# Altium schematic sheet Peripherals.SchDoc: Peripherals
size A4; Project: STM32MP15-DISCO PI; Date: Not used; ApprovedBy: Not used; CheckedBy: Not used; Author: Not used; CompanyName: STMicroelectronics; DrawnBy: Not used; Engineer: Not used; Organization: Not used; Address1: Not used; Address2: Not used; Address3: Not used; Address4: Not used; DocumentNumber: 13; Revision: Not used; SheetNumber: 13; SheetTotal: 15; CurrentTime: Not used; CurrentDate: Not used; Time: Not used; DocumentFullPathAndName: Not used; DocumentName: Not used; ModifiedDate: Not used; ImagePath: Not used; ProjectName: Not used; Application_BuildNumber: Not used
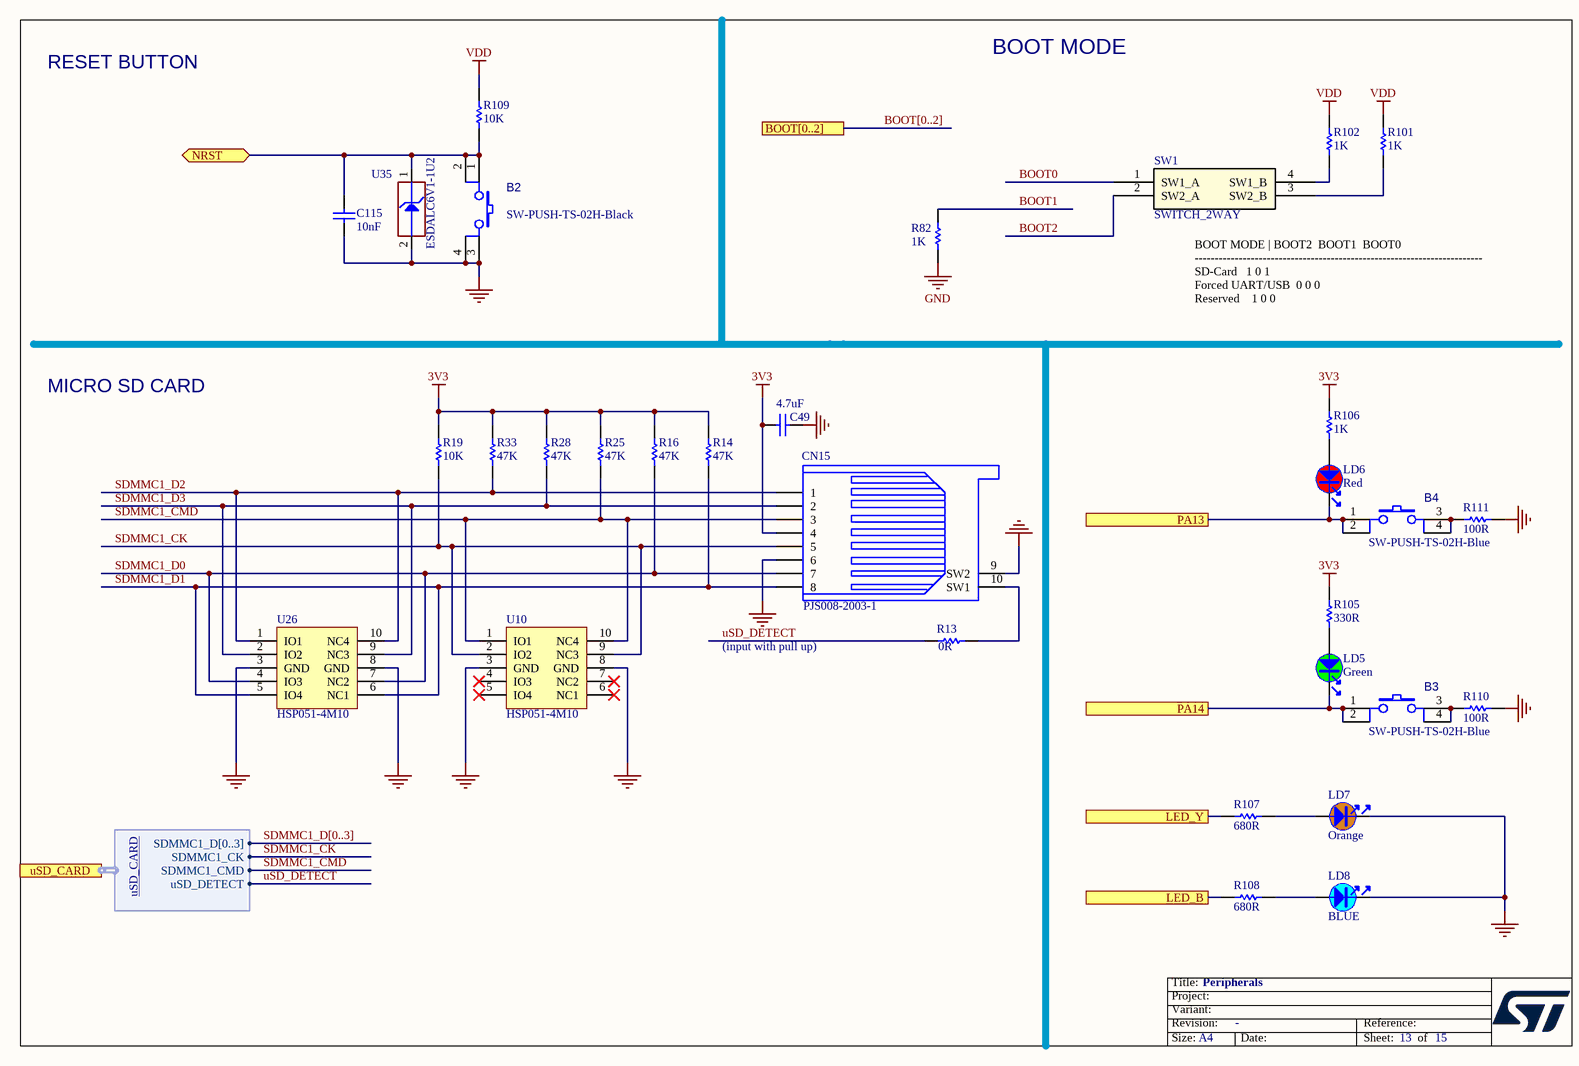
[diagram p0: Peripherals.SchDoc]

## Parts
B2  value SW-PUSH-TS-02H-Black  [SWI_JIUBABA_C-TS-02H-2-5-K-V-T_R_BLACK]
B3  SW-PUSH-TS-02H-Blue  [SWI_JIUBABA_C-TS-02H-2-5-B-V-T_R_BLUE]
B4  SW-PUSH-TS-02H-Blue  [SWI_JIUBABA_C-TS-02H-2-5-B-V-T_R_BLUE]
C49  value 4.7uF  [C0402]  (hidden comment: Capacitor)
C115  value 10nF  [C0402]  (hidden comment: Capacitor)
CN15  value PJS008-2003-1  [CON_MICROSD_YAMAICHI_PJS008-2003-0]
LD5  value Green  [LED_0603_GREEN]  (hidden comment: LED_green)
LD6  value Red  [LED_0603_RED]  (hidden comment: LED_red)
LD7  value Orange  [LED_0603_ORANGE_H0P4]  (hidden comment: LED_orange)
LD8  value BLUE  [LED_0603_SMD-B_BLUE_H0P4]  (hidden comment: LED_blue)
R13  value 0R  [R0402]
R14  value 47K  [R0402]
R16  value 47K  [R0402]
R19  value 10K  [R0402]
R25  value 47K  [R0402]
R28  value 47K  [R0402]
R33  value 47K  [R0402]
R82  value 1K  [R0402]  (hidden comment: Resistor)
R101  value 1K  [R0402]
R102  value 1K  [R0402]
R105  value 330R  [R0402]
R106  value 1K  [R0402]
R107  value 680R  [R0402]  (hidden comment: Resistor)
R108  value 680R  [R0402]  (hidden comment: Resistor)
R109  value 10K  [R0402]
R110  value 100R  [R0402]
R111  value 100R  [R0402]
SW1  SWITCH_2WAY  [SWI_C&K_SDA02H1SBD_2POS]
U10  HSP051-4M10  [ESD_UQFN-10L_2P5X1_P050]
U26  HSP051-4M10  [ESD_UQFN-10L_2P5X1_P050]
U35  value ESDALC6V1-1U2  [ESD_ST0201]  (hidden comment: ESD-TRANSIL)

## Ports
BOOT[0..2], LED_B, LED_Y, NRST (bidir), PA13, PA14, uSD_CARD (harness uSD_CARD)

## Harnesses
uSD_CARD: SDMMC1_D[0..3], SDMMC1_CK, SDMMC1_CMD, uSD_DETECT

## Nets
3V3: C49.2 CN15.4 R14.2 R16.2 R19.2 R25.2 R28.2 R33.2 R105.2 R106.2
GND: B2.3 B2.4 C49.1 C115.1 CN15.6 CN15.9(SW2) LD7.2 LD8.2 R82.1 R110.2 R111.2 U10.3(GND) U10.8(GND) U26.3(GND) U26.8(GND) U35.2(GND)
VDD: R101.2 R102.2 R109.2
BOOT0: SW1.1(SW1_A)
BOOT1: R82.2
BOOT2: SW1.2(SW2_A)
LED_B: R108.1 ; port LED_B
LED_Y: R107.1 ; port LED_Y
NRST: B2.1 B2.2 C115.2 R109.1 U35.1(IO1) ; port NRST
PA13: B4.1 B4.2 LD6.2 ; port PA13
PA14: B3.1 B3.2 LD5.2 ; port PA14
SDMMC1_CK: CN15.5 R19.1 U10.2(IO2) U10.9(NC3) ; port uSD_CARD.SDMMC1_CK
SDMMC1_CMD: CN15.3 R25.1 U10.1(IO1) U10.10(NC4) ; port uSD_CARD.SDMMC1_CMD
SDMMC1_D0: CN15.7 R16.1 U26.4(IO3) U26.7(NC2)
SDMMC1_D1: CN15.8 R14.1 U26.5(IO4) U26.6(NC1)
SDMMC1_D2: CN15.1 R33.1 U26.1(IO1) U26.10(NC4)
SDMMC1_D3: CN15.2 R28.1 U26.2(IO2) U26.9(NC3)
uSD_DETECT: R13.1 ; port uSD_CARD.uSD_DETECT
NetB3_3: B3.3 B3.4 R110.1
NetB4_3: B4.3 B4.4 R111.1
NetCN15_10: CN15.10(SW1) R13.2
NetLD5_1: LD5.1 R105.1
NetLD6_1: LD6.1 R106.1
NetLD7_1: LD7.1 R107.2
NetLD8_1: LD8.1 R108.2
NetR101_1: R101.1 SW1.3(SW2_B)
NetR102_1: R102.1 SW1.4(SW1_B)

Not connected (* = marked no-connect by the designer): U10 4(IO3)* 5(IO4)* 6(NC1)* 7(NC2)*

## Buses and harness runs
bus BOOT[0..2] = port BOOT[0..2]
bus SDMMC1_D[0..3]

## Notes on the sheet
- BOOT MODE
- RESET BUTTON
- (near SW1) BOOT MODE	|	BOOT2 	BOOT1 	BOOT0
  ------------------------------------------------------------------------
  SD-Card			1	0	1
  Forced UART/USB		0	0	0
  Reserved 			1	0	0
- MICRO SD CARD
- (input with pull up)
- Title:
- Project:
- Size:
- Revision:
- Variant:
- A4
- -
- Date:
- Reference:
- Sheet:
- of

## Library data of the parts
B2 = MCD-00171: Switch HW SMD black; Manufacturer_Part_Number: C-TS-02H-2.5-K-V-T/R BLACK; Manufacturer: JIUBABA; Part_Type: Misc; Provided_By: SUBCO; Initial_Board_Reference: MB1264; Internal_Part_Number: MCD-00171; ComponentLink1Description: Datasheet; Status: Checked; ComponentLink1URL: http://tunmcdsvn.tun.st.com/Component_Datasheet_Library/Trunk/Misc/Jiubaba_TS-02H-H2-5
B3 B4 = MCD-00172: Switch HW SMD blue; Part_Type: Misc; Manufacturer_Part_Number: C-TS-02H-2.5-B-V-T/R BLUE; Manufacturer: JIUBABA; Provided_By: SUBCO; Initial_Board_Reference: MB1264; Internal_Part_Number: MCD-00172; Value: SW-PUSH-TS-02H-Blue; Status: Checked; ComponentLink1Description: Datasheet; ComponentLink1URL: http://tunmcdsvn.tun.st.com/Component_Datasheet_Library/Trunk/Misc/Jiubaba_TS-02H-H2-5
C49 = MCD-01356: Capacitor, MLCC, 4.7uF, 6V3, X5R, 20%, 0402, T=0,5mm; Manufacturer_Part_Number: GRM155R60J475ME47; Manufacturer: MURATA; Provided_By: SUBCO; Internal_Part_Number: MCD-01356; Status: Released; Part_Type: Capacitor; Package: C0402; ComponentLink1Description: Datasheet; ComponentLink1URL: http://tunmcdsvn.tun.st.com/Component_Datasheet_Library/Trunk/Capacitors/Murata_Capacitor_GR_series
C115 = MCD-00011: Capacitor, MLCC, 10nF, 16V, X7R, 10%, 0402, T=0.5mm; Manufacturer_Part_Number: CC0402KRX7R7BB103; Manufacturer: YAGEO; Provided_By: SUBCO; Initial_Board_Reference: MB1274; Internal_Part_Number: MCD-00011; Status: Released; Part_Type: Capacitor; Package: C0402; ComponentLink1Description: Datasheet; ComponentLink1URL: http://tunmcdsvn.tun.st.com/Component_Datasheet_Library/Trunk/Capacitors/Yageo_Multilayer_Capacitor_X7R_series_100pF_to_22uF; ECCN_US: n/a; ECCN_EU: n/a
CN15 = MCD-00023: MicroSD Card Conn, Reversed-Type, Mnt Push-Push; Manufacturer: YAMAICHI; Part_Type: Connector; Provided_By: SUBCO; Initial_Board_Reference: mb1274; Internal_Part_Number: MCD-00023; Manufacturer_Part_Number: PJS008-2003-1; ComponentLink1Description: Datasheet; ECCN_US: n/a; ECCN_EU: n/a; Status: Released; ComponentLink1URL: http://tunmcdsvn.tun.st.com/Component_Datasheet_Library/Trunk/Connectors/Yamaichi_Connector_microSD-Card-PJS008-2003
LD5 = MCD-02900: LED, Green, 2V, 20mA, 0603; Part_Type: Display; Part_Preference: Recommended; Manufacturer: EVERLIGHT; Manufacturer_Part_Number: 19-213SYGC/S530-E2/5T; Full_Alternate_Internal_Part_Number: MCD-00320; Partial_Alternate_Internal_Part_Number: MCD-00050; Component_Country_Of_Origin: China; ShowFields: YES; ID: 5016; Internal_Part_Number: MCD-02900; Status: Checked; Package: 0603; ComponentLink1URL: http://tunmcdsvn.tun.st.com/Component_Documentation_Library/Trunk/Display/EVERLIGHT_19-213SYGC-S530-E2-5T; Order_Code_Digikey: 1080-19-213SYGC/S530-E2/5TTR-ND; Order_Code_Farnell: N/A; Order_Code_RS: N/A
LD6 = MCD-02899: LED, Red, 2V35, 20mA, 0603; Part_Type: Display; Part_Preference: Recommended; Manufacturer: EVERLIGHT; Manufacturer_Part_Number: 19-213/R6C-AP1Q2B/5T; Full_Alternate_Internal_Part_Number: MCD-00049; Component_Country_Of_Origin: China; ShowFields: YES; ID: 5015; Internal_Part_Number: MCD-02899; Status: Checked; Package: 0603; ComponentLink1URL: http://tunmcdsvn.tun.st.com/Component_Documentation_Library/Trunk/Display/EVERLIGHT_19-213-R6C-AP1Q2B-5T; Order_Code_Digikey: 1080-19-213/R6C-AP1Q2B/5TTR-ND; Order_Code_Farnell: N/A; Order_Code_RS: N/A
LD7 = MCD-02785: LED, Orange, 2V2, 5mA, 0603; Part_Type: Display; Part_Preference: Recommended; Manufacturer: EVERLIGHT; Manufacturer_Part_Number: 19-217/S2C-AM2N2VY/6T; Full_Alternate_Internal_Part_Number: MCD-00321; Component_Country_Of_Origin: China; ShowFields: YES; ID: 4897; Internal_Part_Number: MCD-02785; Status: Checked; Package: 0603; ComponentLink1URL: http://tunmcdsvn.tun.st.com/Component_Documentation_Library/Trunk/Display/EVERLIGHT_19-217-S2C-AM2N2VY-6T; Order_Code_Digikey: 1080-19-217/S2C-AM2N2VY/6TTR-ND; Order_Code_Farnell: N/A; Order_Code_RS: N/A
LD8 = MCD-02786: LED, Blue, VF: Min=2.5V, Max=3.1V, 10mA, 0603; Part_Type: Display; Part_Preference: Recommended; Manufacturer: EVERLIGHT; Manufacturer_Part_Number: 19-217/BHC-ZL1M2RY/6T; Full_Alternate_Internal_Part_Number: MCD-01131; Component_Country_Of_Origin: China; ShowFields: YES; ID: 4898; Internal_Part_Number: MCD-02786; Status: Checked; Package: 0603; ComponentLink1URL: http://tunmcdsvn.tun.st.com/Component_Documentation_Library/Trunk/Display/EVERLIGHT_19-217-BHC-ZL1M2RY-6T; Order_Code_Digikey: 1080-19-217/BHC-ZL1M2RY/6TTR-ND; Order_Code_Farnell: N/A; Order_Code_RS: N/A
R13 = MCD-00052: Resistor,0R,0402,5%,1/16W; Manufacturer_Part_Number: RC0402JR-070RL; Manufacturer: YAGEO; Provided_By: SUBCO; Initial_Board_Reference: mb1274; Internal_Part_Number: MCD-00052; ComponentLink1Description: Datasheet; ECCN_US: n/a; ECCN_EU: n/a; Status: Released; Part_Type: Resistor; ComponentLink1URL: http://tunmcdsvn.tun.st.com/Component_Datasheet_Library/Trunk/Resistors/Yageo_Resistor_RC0402-series; Package: R0402
R14 R16 R25 R28 R33 = MCD-00063: Resistor,47K,0402,1%,1/16W; Manufacturer_Part_Number: RC0402FR-0747KL; Manufacturer: YAGEO; Provided_By: SUBCO; Initial_Board_Reference: mb1274; Internal_Part_Number: MCD-00063; ComponentLink1Description: Datasheet; ECCN_US: n/a; ECCN_EU: n/a; Status: Released; Part_Type: Resistor; ComponentLink1URL: http://tunmcdsvn.tun.st.com/Component_Datasheet_Library/Trunk/Resistors/Yageo_Resistor_RC0402-series; Package: R0402
R19 R109 = MCD-00053: Resistor,10K,0402,1%,1/16W; Manufacturer_Part_Number: RC0402FR-0710KL; Manufacturer: YAGEO; Provided_By: SUBCO; Initial_Board_Reference: mb1274; Internal_Part_Number: MCD-00053; ComponentLink1Description: Datasheet; ECCN_US: n/a; ECCN_EU: n/a; Status: Released; Part_Type: Resistor; ComponentLink1URL: http://tunmcdsvn.tun.st.com/Component_Datasheet_Library/Trunk/Resistors/Yageo_Resistor_RC0402-series; Package: R0402
R82 = MCD-00061: Resistor,1K,0402,1%,1/16W; Manufacturer_Part_Number: RC0402FR-071KL; Manufacturer: YAGEO; Provided_By: SUBCO; Initial_Board_Reference: MB1274; Internal_Part_Number: MCD-00061; Status: Released; Part_Type: Resistor; Package: R0402; ComponentLink1Description: Datasheet; ComponentLink1URL: http://tunmcdsvn.tun.st.com/Component_Datasheet_Library/Trunk/Resistors/Yageo_Resistor_RC0402-series; ECCN_US: n/a; ECCN_EU: n/a
R101 R102 R106 = MCD-00061: Resistor,1K,0402,1%,1/16W; Manufacturer_Part_Number: RC0402FR-071KL; Manufacturer: YAGEO; Provided_By: SUBCO; Initial_Board_Reference: mb1274; Internal_Part_Number: MCD-00061; ComponentLink1Description: Datasheet; ECCN_US: n/a; ECCN_EU: n/a; Status: Released; Part_Type: Resistor; ComponentLink1URL: http://tunmcdsvn.tun.st.com/Component_Datasheet_Library/Trunk/Resistors/Yageo_Resistor_RC0402-series; Package: R0402
R105 = MCD-00062: Resistor,330R,0402,1%,1/16W; Manufacturer_Part_Number: RC0402FR-07330RL; Manufacturer: YAGEO; Provided_By: SUBCO; Initial_Board_Reference: mb1274; Internal_Part_Number: MCD-00062; ComponentLink1Description: Datasheet; ECCN_US: n/a; ECCN_EU: n/a; Status: Released; Part_Type: Resistor; ComponentLink1URL: http://tunmcdsvn.tun.st.com/Component_Datasheet_Library/Trunk/Resistors/Yageo_Resistor_RC0402-series; Package: R0402
R107 R108 = MCD-00507: Resistor,680R,0402,1%,1/16W; Manufacturer_Part_Number: RC0402FR-07680RL; Manufacturer: YAGEO; Provided_By: SUBCO; Internal_Part_Number: MCD-00507; Status: Released; Part_Type: Resistor; Package: R0402; ComponentLink1Description: Datasheet; ComponentLink1URL: http://tunmcdsvn.tun.st.com/Component_Datasheet_Library/Trunk/Resistors/Yageo_Resistor_RC0402-series; ECCN_US: n/a; ECCN_EU: n/a
R110 R111 = MCD-00067: Resistor,100R,0402,1%,1/16W; Manufacturer_Part_Number: RC0402FR-07100RL; Manufacturer: YAGEO; Provided_By: SUBCO; Initial_Board_Reference: mb1274; Internal_Part_Number: MCD-00067; ComponentLink1Description: Datasheet; ECCN_US: n/a; ECCN_EU: n/a; Status: Released; Part_Type: Resistor; ComponentLink1URL: http://tunmcdsvn.tun.st.com/Component_Datasheet_Library/Trunk/Resistors/Yageo_Resistor_RC0402-series; Package: R0402
SW1 = MCD-00658: Dip Switch ,2Position ,Surface Mount Slide (Standard) ,2.54 pitch,25mA 24VDC; Part_Type: Misc; Manufacturer_Part_Number: SDA02H1SBD; Manufacturer: C&K; Provided_By: SUBCO; Initial_Board_Reference: MB1272; Internal_Part_Number: MCD-00658; Value: SWITCH_2WAY; Status: Footprint available; Package: DIP; ComponentLink1Description: Datasheet; ComponentLink1URL: http://tunmcdsvn.tun.st.com/Component_Datasheet_Library/Trunk/Misc/CK_switch_dip_sda_series; ECCN_US: n/a; ECCN_EU: n/a
U10 U26 = MCD-00667: 4-line ESD protection for high speed lines; Part_Type: Diode; Manufacturer: STMICROELECTRONICS; BMS_Part_Number: 9179041; ECCN_US: EAR99; ECCN_EU: NEC; Provided_By: SUBCO with ST control; Initial_Board_Reference: MB1331; Internal_Part_Number: MCD-00667; Value: HSP051-4M10; Status: Checked; Manufacturer_Part_Number: HSP051-4M10; Package: uQFN-10L; ComponentLink1Description: Datasheet; ComponentLink1URL: http://tunmcdsvn.tun.st.com/Component_Datasheet_Library/Trunk/Diodes/STM_ESD_HSP051-4M10
U35 = MCD-00170: ESD protection 6V1; Part_Type: Diode; Manufacturer: STMICROELECTRONICS; BMS_Part_Number: 9151132; ECCN_US: EAR99; ECCN_EU: NEC; Provided_By: SUBCO with ST control; Initial_Board_Reference: MB1274; Internal_Part_Number: MCD-00170; Status: Released; Manufacturer_Part_Number: ESDALC6V1-1U2; ComponentLink1Description: Datasheet; ComponentLink1URL: http://tunmcdsvn.tun.st.com/Component_Datasheet_Library/Trunk/Diodes/STM_ESD_ESDALC6V1-1U2